# Altium schematic sheet Power-2.SchDoc: =ProjectTitle (part 2 of 2)
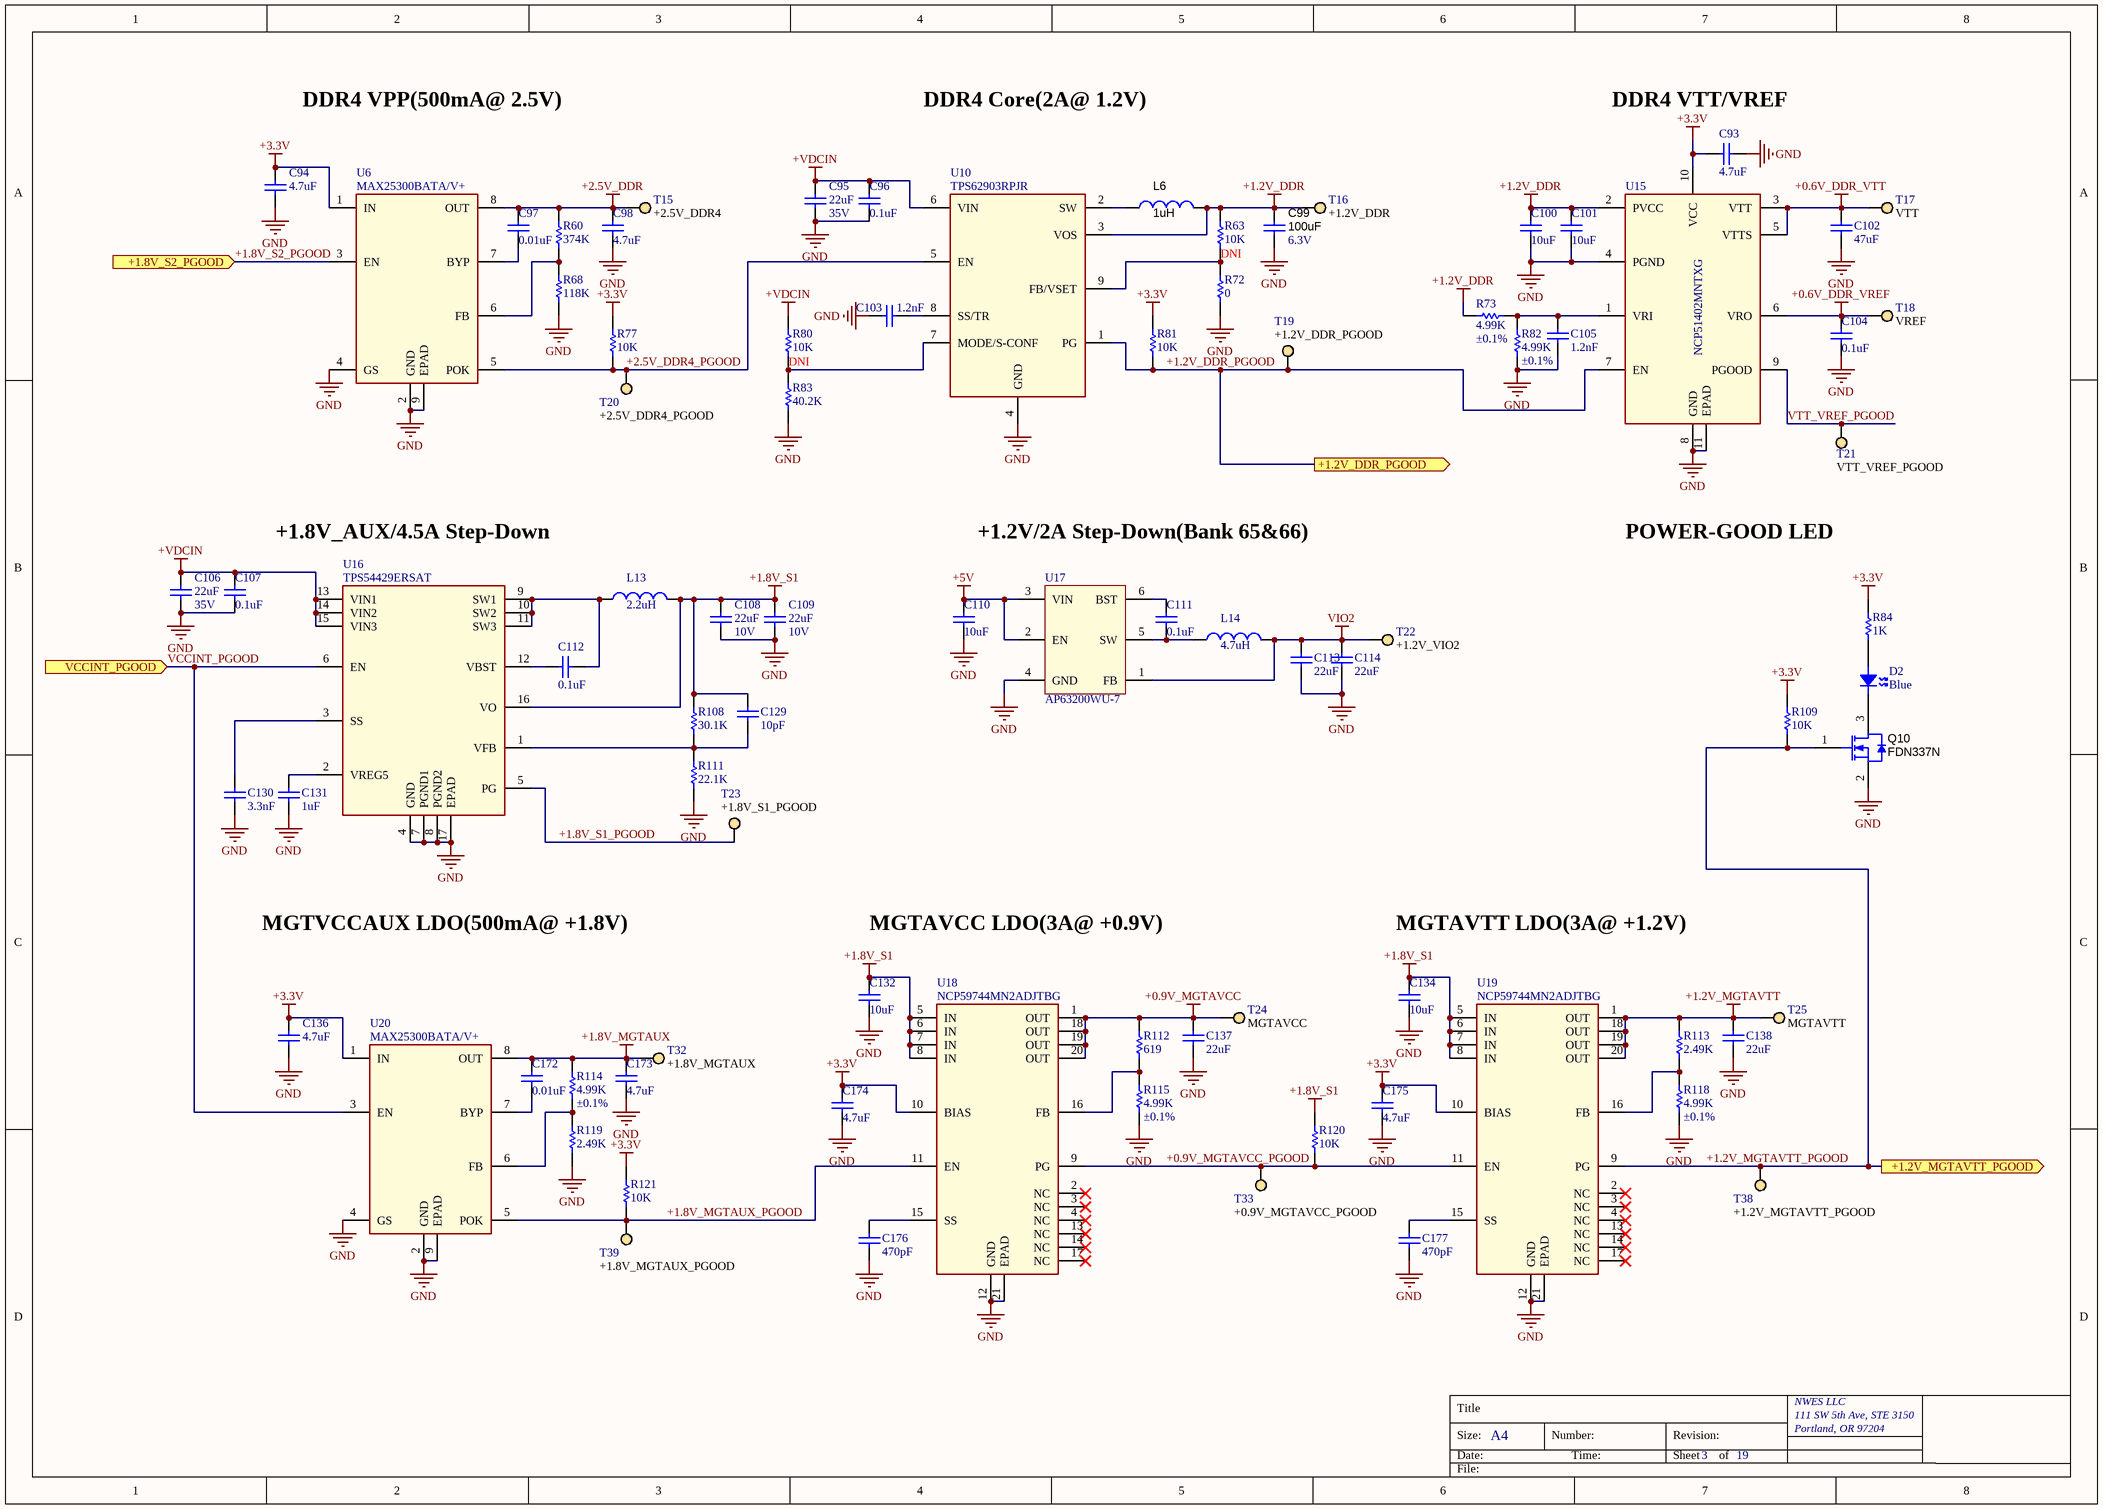
[diagram p1: Power-2.SchDoc]

## Library data of the parts
C93 C94 C98 C136 C173-C175 = CAP CER 4.7UF 10V X5R 0402: Manufacturer Part Number: C1005X5R1A475M050BC; Manufacturer: TDK Corporation; Package: 0402; Supplier Part Number 1: 445-8023-1-ND; Value: 4.7uF; Supplier 1: Digi-Key
C95 C106 = CAP CER 22UF 35V X5R 1206: C Series 1206 22 uF 35 V ±20 % Tolerance X5R SMT Multilayer Ceramic Capacitor; Manufacturer: TDK; Manufacturer Part Number: C3216X5R1V226M160AC; Tolerance: 20%; Supplier 1: Digi-Key; RoHS: Yes; Category: Ceramic Capacitors; Stock 1: 1100049; Pricing 1: 1=0.95000, 10=0.72200, 50=0.60000, 100=0.51660, 500=0.39996, 1000=0.34441 (USD); Mount: Surface Mount; Case/Package: 1206; Case Code (Metric): 3216; Case Code (Imperial): 1206; Weight: 0.000571oz; Dielectric Material: Ceramic; Min Operating Temperature: -55°C; Max Operating Temperature: 85°C; Capacitance: 22uF; Packaging: Tape and Reel; Termination: SMD/SMT; Series: C; Package Quantity: 2000; Voltage Rating (DC): 35V; Dielectric: X5R; Resistor Type: Ceramic; Voltage: 35V; Construction: Flat; Length: 3.2mm; Width: 0.063inch; Height: 1.6mm; Depth: 1.6mm; Thickness: 1.6mm; Radiation Hardening: No; Lead Free: Lead Free; RoHS Compliant: Yes; ComponentLink1URL: https://datasheet.ciiva.com/24216/c3216x5r1v226m160ac-265035-24216573.pdf?src-supplier=Mouser; ComponentLink1Description: https://datasheet.ciiva.com/24216/c3216x5r1v226m160ac-265035-24216573.pdf?src-supplier=Mouser; ComponentLink2URL: https://datasheet.ciiva.com/23803/1796654-23803046.pdf?src-supplier=Newark; ComponentLink2Description: https://datasheet.ciiva.com/23803/1796654-23803046.pdf?src-supplier=Newark; ComponentLink3URL: https://datasheet.ciiva.com/22725/1913358-22725591.pdf?src-supplier=Element14; ComponentLink3Description: https://datasheet.ciiva.com/22725/1913358-22725591.pdf?src-supplier=Element14; ComponentLink4URL: https://datasheet.ciiva.com/22725/1913358-22725592.pdf?src-supplier=Element14; ComponentLink4Description: https://datasheet.ciiva.com/22725/1913358-22725592.pdf?src-supplier=Element14; ComponentLink5URL: https://datasheet.ciiva.com/6259/tdkmlcccaprange-6259231.pdf?src-supplier=Digi-Key; ComponentLink5Description: https://datasheet.ciiva.com/6259/tdkmlcccaprange-6259231.pdf?src-supplier=Digi-Key; Supplier Part Number 1: 445-8045-1-ND
C96 C104 C107 C111 C112 = CAP CER 0.1UF 25V X5R 0402: Manufacturer Part Number: CL05A104KA5NNNC; Manufacturer: Samsung Electro-Mechanics; Supplier Part Number 1: 1276-1043-1-ND; Package: 0402; Height: 0.55mm; Supplier 1: Digi-Key; value: 0.1uF
C97 C172 = CAP CER 0.01uF 50V X7R 0402: CAP CER 10000PF 50V X7R 0402; Manufacturer Part Number: GCM155R71H103KA55D; Manufacturer: Murata Electronics; Supplier Part Number 1: 490-4762-1-ND; Package: 0402; Height: 0.55mm; Supplier 1: Digi-Key; value: 0.01uF
C99 = CAP CER 100UF 6.3V X5R 1206: 1206 100 uF 6.3 V ±20% Tolerance X5R SMT Multilayer Ceramic Capacitor; Manufacturer: Murata; Manufacturer Part Number: GRM31CR60J107ME39L; Supplier 1: Mouser; RoHS: Yes; Category: Ceramic Capacitors; Stock 1: 589630; Pricing 1: 1=1.08000, 10=0.79300, 50=0.79300, 100=0.54400, 1000=0.53900, 10000=0.44000 (USD); Mount: Surface Mount; Case/Package: 1206; Case Code (Metric): 3216; Case Code (Imperial): 1206; Min Operating Temperature: -55°C; Max Operating Temperature: 85°C; Packaging: Cut Tape; Voltage Rating: 6.3V; Dielectric: X5R; Tolerance: 20%; Capacitance: 100uF; Series: GRM; Length: 3.2mm; Width: 1.6mm; Thickness: 0.071inch; Reach SVHC Compliant: Yes; RoHS Compliant: Yes; ComponentLink1URL: https://datasheet.ciiva.com/142/grm31cr60j107me39-01-142571.pdf?src-supplier=Digi-Key; ComponentLink1Description: https://datasheet.ciiva.com/142/grm31cr60j107me39-01-142571.pdf?src-supplier=Digi-Key; ComponentLink2URL: https://datasheet.ciiva.com/142/grm31cr60j107me39-01-142572.pdf?src-supplier=Digi-Key; ComponentLink2Description: https://datasheet.ciiva.com/142/grm31cr60j107me39-01-142572.pdf?src-supplier=Digi-Key; ComponentLink3URL: https://datasheet.ciiva.com/3776/255grm31cr60j107me3923-3776999.pdf?src-supplier=Arrow+Electronics; ComponentLink3Description: https://datasheet.ciiva.com/3776/255grm31cr60j107me3923-3776999.pdf?src-supplier=Arrow+Electronics; ComponentLink4URL: https://datasheet.ciiva.com/11787/0900766b80ef921d-11787809.pdf?src-supplier=Rs; ComponentLink4Description: https://datasheet.ciiva.com/11787/0900766b80ef921d-11787809.pdf?src-supplier=Rs; ComponentLink5URL: https://datasheet.ciiva.com/29202/451152-da-01-de-vs-chip-kond-1206-100-0-uf-20pr-6-3v-x5r-29202463.pdf?src-supplier=Conrad; ComponentLink5Description: https://datasheet.ciiva.com/29202/451152-da-01-de-vs-chip-kond-1206-100-0-uf-20pr-6-3v-x5r-29202463.pdf?src-supplier=Conrad; Supplier Part Number 1: 81-GRM31CR60J107ME9L; Material: Ceramic; Weight: 0.001411oz; Package Quantity: 2000; Termination: Standard; Voltage: 6.3V; Height: 1.6mm; Depth: 1.6mm; Radiation Hardening: No; Lead Free: Lead Free; ComponentLink6URL: https://datasheet.ciiva.com/29199/454804-da-01-en-vs-kondensator-1206-29199543.pdf?src-supplier=Conrad; ComponentLink6Description: https://datasheet.ciiva.com/29199/454804-da-01-en-vs-kondensator-1206-29199543.pdf?src-supplier=Conrad; ComponentLink7URL: https://datasheet.ciiva.com/14116/grmseries-highdielectrictype-eng-14116431.pdf?src-supplier=Distrelec; ComponentLink7Description: https://datasheet.ciiva.com/14116/grmseries-highdielectrictype-eng-14116431.pdf?src-supplier=Distrelec; ComponentLink8URL: https://datasheet.ciiva.com/142/grm31cr60j107me39-01-142570.pdf?src-supplier=Digi-Key; ComponentLink8Description: https://datasheet.ciiva.com/142/grm31cr60j107me39-01-142570.pdf?src-supplier=Digi-Key; ComponentLink9URL: https://datasheet.ciiva.com/5416/product-5416441.pdf?src-supplier=Mouser; ComponentLink9Description: https://datasheet.ciiva.com/5416/product-5416441.pdf?src-supplier=Mouser; ComponentLink10URL: https://datasheet.ciiva.com/16461/product-16461259.pdf?src-supplier=Future+Electronics; ComponentLink10Description: https://datasheet.ciiva.com/16461/product-16461259.pdf?src-supplier=Future+Electronics
C100 C101 C110 C132 C134 = CAP CER 10UF 10V X5R 0402: Manufacturer Part Number: CL05A106MP8NUB8; Manufacturer: Samsung Electro-Mechanics; Part #: E-CAP-042; Supplier Part Number 1: 1276-6830-2-ND; Package: 0402; value: 10uF; Supplier 1: Digi-Key; Height: 0.9mm; ComponentLink1Description: New link; ComponentLink1URL: *
C102 = CAP CER 47UF 6.3V X5R 0805: Manufacturer: Samsung; Manufacturer Part Number: CL21A476MQYNNNE; Tolerance: 20%; Supplier 1: Digi-Key; RoHS: Yes; Category: Ceramic Capacitors; Stock 1: 1673694; Pricing 1: 1=0.29000, 10=0.20200, 50=0.13440, 100=0.11420, 500=0.08064, 1000=0.07057 (USD); Mount: Surface Mount; Case/Package: 0805; Case Code (Metric): 2012; Case Code (Imperial): 0805; Contact Plating: Tin; Min Operating Temperature: -55°C; Max Operating Temperature: 85°C; Capacitance: 47uF; Package Quantity: 1; Packaging: Tape and Reel; Dielectric: X5R; Series: CL; Construction: Flat; Length: 2mm; Width: 0.049inch; Height: 1.25mm; Thickness: 0.057inch; Depth: 1.25mm; Radiation Hardening: No; RoHS Compliant: Yes; ComponentLink1URL: https://datasheet.ciiva.com/25791/cl21a476mqynnne-25791153.pdf?src-supplier=Digi-Key; ComponentLink1Description: https://datasheet.ciiva.com/25791/cl21a476mqynnne-25791153.pdf?src-supplier=Digi-Key; ComponentLink2URL: https://datasheet.ciiva.com/26838/getdatasheetpartid-359050-26838632.pdf?src-supplier=Verical; ComponentLink2Description: https://datasheet.ciiva.com/26838/getdatasheetpartid-359050-26838632.pdf?src-supplier=Verical; Supplier Part Number 1: 1276-1852-1-ND; Voltage Rating: 6.3V
C103 C105 = CAP CER 1200PF 50V X7R 0402: 0402 1.2 nF 50 V ±10% Tolerance X7R SMT Multilayer Ceramic Capacitor; Manufacturer: Murata; Manufacturer Part Number: GRM155R71H122KA01D; Voltage Rating: 50V; Supplier 1: Digi-Key; RoHS: Yes; Category: Ceramic Capacitors; Stock 1: 373559; Pricing 1: 1=0.10000, 10=0.02800, 50=0.01520, 100=0.01240, 500=0.00886, 1000=0.00696, 2500=0.00632, 5000=0.00582 (USD); Mount: Surface Mount; Case/Package: 0402; Case Code (Metric): 1005; Case Code (Imperial): 0402; Material: Ceramic; Min Operating Temperature: -55°C; Max Operating Temperature: 125°C; Capacitance: 1.2nF; Tolerance: 10%; Dielectric: X7R; Packaging: Tape and Reel; Package Quantity: 1; Voltage Rating (DC): 50V; Termination: SMD/SMT; Voltage: 50V; Series: GRM; Construction: Flat; Length: 1mm; Width: 0.5mm; Height: 0.5mm; Thickness: 0.022inch; Depth: 0.5mm; Radiation Hardening: No; Lead Free: Lead Free; RoHS Compliant: Yes; ComponentLink1URL: https://datasheet.ciiva.com/18184/getdatasheetpartid-220777-18184722.pdf?src-supplier=Verical; ComponentLink1Description: https://datasheet.ciiva.com/18184/getdatasheetpartid-220777-18184722.pdf?src-supplier=Verical; ComponentLink2URL: https://datasheet.ciiva.com/161/partnumbering-e-01-161460.pdf?src-supplier=Digi-Key; ComponentLink2Description: https://datasheet.ciiva.com/161/partnumbering-e-01-161460.pdf?src-supplier=Digi-Key; ComponentLink3URL: https://datasheet.ciiva.com/161/partnumbering-e-01-161459.pdf?src-supplier=Digi-Key; ComponentLink3Description: https://datasheet.ciiva.com/161/partnumbering-e-01-161459.pdf?src-supplier=Digi-Key; ComponentLink4URL: https://datasheet.ciiva.com/161/partnumbering-e-01-161461.pdf?src-supplier=Digi-Key; ComponentLink4Description: https://datasheet.ciiva.com/161/partnumbering-e-01-161461.pdf?src-supplier=Digi-Key; ComponentLink5URL: https://datasheet.ciiva.com/2989/product-2989402.pdf?src-supplier=Avnet; ComponentLink5Description: https://datasheet.ciiva.com/2989/product-2989402.pdf?src-supplier=Avnet; Supplier Part Number 1: 490-1304-1-ND
C108 C109 = CAP CER 22UF 10V X5R 0603: Multilayer Ceramic Capacitor, 22 uF, 10 V, ± 20%, X5R, 0603 [1608 Metric]; Manufacturer: TDK; Manufacturer Part Number: C1608X5R1A226M080AC; Supplier 1: Digi-Key; RoHS: Yes; Category: Ceramic Capacitors; Stock 1: 4100481; Pricing 1: 1=0.45000, 10=0.31300, 50=0.21920, 100=0.18790, 500=0.14090, 1000=0.11898 (USD); Mount: Surface Mount; Case/Package: 0603; Case Code (Metric): 1608; Case Code (Imperial): 0603; Dielectric Material: Ceramic; Weight: 7.1E-05oz; Min Operating Temperature: -55°C; Max Operating Temperature: 85°C; Tolerance: 20%; Capacitance: 22uF; Packaging: Tape and Reel; Voltage Rating (DC): 10V; Termination: SMD/SMT; Series: C; Package Quantity: 4000; Dielectric: X5R; Resistor Type: Ceramic; Length: 1.6mm; Width: 0.8mm; Height: 0.8mm; Thickness: 0.035inch; Depth: 0.8mm; Reach SVHC Compliant: Yes; Lead Free: Lead Free; RoHS Compliant: Yes; ComponentLink1URL: https://datasheet.ciiva.com/6274/tdkmlcccaprange-6274860.pdf?src-supplier=Digi-Key; ComponentLink1Description: https://datasheet.ciiva.com/6274/tdkmlcccaprange-6274860.pdf?src-supplier=Digi-Key; ComponentLink2URL: https://datasheet.ciiva.com/6274/tdkmlcccaprange-6274859.pdf?src-supplier=Digi-Key; ComponentLink2Description: https://datasheet.ciiva.com/6274/tdkmlcccaprange-6274859.pdf?src-supplier=Digi-Key; ComponentLink3URL: https://datasheet.ciiva.com/6274/tdkmlcccaprange-6274861.pdf?src-supplier=Digi-Key; ComponentLink3Description: https://datasheet.ciiva.com/6274/tdkmlcccaprange-6274861.pdf?src-supplier=Digi-Key; ComponentLink4URL: https://datasheet.ciiva.com/24216/mlcc-commercial-general-en-24216575.pdf?src-supplier=Mouser; ComponentLink4Description: https://datasheet.ciiva.com/24216/mlcc-commercial-general-en-24216575.pdf?src-supplier=Mouser; Supplier Part Number 1: 445-9077-1-ND
C113 C114 C137 C138 = CAP CER 22UF 10V X5R 0603: Multilayer Ceramic Capacitor, 22 uF, 10 V, ± 20%, X5R, 0603 [1608 Metric]; Manufacturer: TDK; Manufacturer Part Number: C1608X5R1A226M080AC; Voltage Rating: 10V; Supplier 1: Digi-Key; RoHS: Yes; Category: Ceramic Capacitors; Stock 1: 4100481; Pricing 1: 1=0.45000, 10=0.31300, 50=0.21920, 100=0.18790, 500=0.14090, 1000=0.11898 (USD); Mount: Surface Mount; Case/Package: 0603; Case Code (Metric): 1608; Case Code (Imperial): 0603; Dielectric Material: Ceramic; Weight: 7.1E-05oz; Min Operating Temperature: -55°C; Max Operating Temperature: 85°C; Tolerance: 20%; Capacitance: 22uF; Packaging: Tape and Reel; Voltage Rating (DC): 10V; Termination: SMD/SMT; Series: C; Package Quantity: 4000; Dielectric: X5R; Resistor Type: Ceramic; Length: 1.6mm; Width: 0.8mm; Height: 0.8mm; Thickness: 0.035inch; Depth: 0.8mm; Reach SVHC Compliant: Yes; Lead Free: Lead Free; RoHS Compliant: Yes; ComponentLink1URL: https://datasheet.ciiva.com/6274/tdkmlcccaprange-6274860.pdf?src-supplier=Digi-Key; ComponentLink1Description: https://datasheet.ciiva.com/6274/tdkmlcccaprange-6274860.pdf?src-supplier=Digi-Key; ComponentLink2URL: https://datasheet.ciiva.com/6274/tdkmlcccaprange-6274859.pdf?src-supplier=Digi-Key; ComponentLink2Description: https://datasheet.ciiva.com/6274/tdkmlcccaprange-6274859.pdf?src-supplier=Digi-Key; ComponentLink3URL: https://datasheet.ciiva.com/6274/tdkmlcccaprange-6274861.pdf?src-supplier=Digi-Key; ComponentLink3Description: https://datasheet.ciiva.com/6274/tdkmlcccaprange-6274861.pdf?src-supplier=Digi-Key; ComponentLink4URL: https://datasheet.ciiva.com/24216/mlcc-commercial-general-en-24216575.pdf?src-supplier=Mouser; ComponentLink4Description: https://datasheet.ciiva.com/24216/mlcc-commercial-general-en-24216575.pdf?src-supplier=Mouser; Supplier Part Number 1: 445-9077-1-ND
C129 = CAP CER 10PF 50V C0G/NP0 0402: 0402 10 pF 50 V ±5% Tolerance C0G SMT Multilayer Ceramic Capacitor; Manufacturer: Murata; Manufacturer Part Number: GRM1555C1H100JA01D; Voltage Rating: 50V; Temperature Coefficient: 30ppm/°C; Supplier 1: Digi-Key; RoHS: Yes; Category: Ceramic Capacitors; Stock 1: 7638732; Pricing 1: 1=0.10000, 10=0.02200, 50=0.01220, 100=0.00990, 500=0.00708, 1000=0.00556, 2500=0.00505, 5000=0.00465 (USD); Mount: Surface Mount; Case/Package: 0402; Number of Pins: 2; Case Code (Metric): 1005; Case Code (Imperial): 0402; Material: Ceramic; Min Operating Temperature: -55°C; Max Operating Temperature: 125°C; Capacitance: 10pF; Dielectric: C0G; Packaging: Tape and Reel; Package Quantity: 1; Voltage Rating (DC): 50V; Termination: SMD/SMT; Series: GRM; Tolerance: 5%; Voltage: 50V; Construction: Flat; Length: 1mm; Width: 0.02inch; Height: 0.5mm; Thickness: 0.022inch; Depth: 0.5mm; Radiation Hardening: No; RoHS Compliant: Yes; Lead Free: Lead Free; Reach SVHC Compliant: Yes; ComponentLink1URL: https://datasheet.ciiva.com/2989/product-2989280.pdf?src-supplier=Avnet; ComponentLink1Description: https://datasheet.ciiva.com/2989/product-2989280.pdf?src-supplier=Avnet; ComponentLink2URL: https://datasheet.ciiva.com/18184/getdatasheetpartid-307234-18184164.pdf?src-supplier=Verical; ComponentLink2Description: https://datasheet.ciiva.com/18184/getdatasheetpartid-307234-18184164.pdf?src-supplier=Verical; ComponentLink3URL: https://datasheet.ciiva.com/29200/453545-da-01-en-vs-kondensator-0402-29200107.pdf?src-supplier=Conrad; ComponentLink3Description: https://datasheet.ciiva.com/29200/453545-da-01-en-vs-kondensator-0402-29200107.pdf?src-supplier=Conrad; ComponentLink4URL: https://datasheet.ciiva.com/7828/1666664-7828812.pdf?src-supplier=Element14; ComponentLink4Description: https://datasheet.ciiva.com/7828/1666664-7828812.pdf?src-supplier=Element14; ComponentLink5URL: https://datasheet.ciiva.com/6271/partnumbering-e-01-6271159.pdf?src-supplier=Digi-Key; ComponentLink5Description: https://datasheet.ciiva.com/6271/partnumbering-e-01-6271159.pdf?src-supplier=Digi-Key; ComponentLink6URL: https://datasheet.ciiva.com/6271/partnumbering-e-01-6271158.pdf?src-supplier=Digi-Key; ComponentLink6Description: https://datasheet.ciiva.com/6271/partnumbering-e-01-6271158.pdf?src-supplier=Digi-Key; ComponentLink7URL: https://datasheet.ciiva.com/6271/partnumbering-e-01-6271068.pdf?src-supplier=Digi-Key; ComponentLink7Description: https://datasheet.ciiva.com/6271/partnumbering-e-01-6271068.pdf?src-supplier=Digi-Key; ComponentLink8URL: https://datasheet.ciiva.com/48671/product-48671350.pdf?src-supplier=Avnet; ComponentLink8Description: https://datasheet.ciiva.com/48671/product-48671350.pdf?src-supplier=Avnet; Supplier Part Number 1: 490-5921-1-ND
C130 = CAP CER 3300PF 50V X7R 0402: 0402 3.3 nF 50 V ±10% Tolerance X7R SMT Multilayer Ceramic Capacitor; Manufacturer: Murata; Manufacturer Part Number: GRM155R71H332KA01D; Voltage Rating (DC): 50V; Dissipation Factor: 0.025%; Insulation Resistance: 10GR; Supplier 1: Digi-Key; RoHS: Yes; Category: Ceramic Capacitors; Stock 1: 1429301; Pricing 1: 1=0.10000, 10=0.02800, 50=0.01520, 100=0.01240, 500=0.00886, 1000=0.00696, 2500=0.00632, 5000=0.00582 (USD); Mount: Surface Mount; Case/Package: 0402; Case Code (Metric): 1005; Case Code (Imperial): 0402; Material: Ceramic; Min Operating Temperature: -55°C; Max Operating Temperature: 125°C; Capacitance: 3.3nF; Tolerance: 10%; Package Quantity: 1; Packaging: Tape and Reel; Voltage Rating: 50V; Dielectric: X7R; Termination: SMD/SMT; Voltage: 50V; Series: GRM; Construction: Flat; Length: 1mm; Width: 0.02inch; Height: 0.5mm; Thickness: 0.022inch; Depth: 0.5mm; Radiation Hardening: No; Reach SVHC Compliant: Yes; Lead Free: Lead Free; RoHS Compliant: Yes; ComponentLink1URL: https://datasheet.ciiva.com/129/grm155r71h332ka01-01-129766.pdf?src-supplier=Digi-Key; ComponentLink1Description: https://datasheet.ciiva.com/129/grm155r71h332ka01-01-129766.pdf?src-supplier=Digi-Key; ComponentLink2URL: https://datasheet.ciiva.com/129/grm155r71h332ka01-01-129767.pdf?src-supplier=Digi-Key; ComponentLink2Description: https://datasheet.ciiva.com/129/grm155r71h332ka01-01-129767.pdf?src-supplier=Digi-Key; ComponentLink3URL: https://datasheet.ciiva.com/11789/0900766b80ef921d-11789161.pdf?src-supplier=RSComponents; ComponentLink3Description: https://datasheet.ciiva.com/11789/0900766b80ef921d-11789161.pdf?src-supplier=RSComponents; ComponentLink4URL: https://datasheet.ciiva.com/5422/product-5422403.pdf?src-supplier=Mouser; ComponentLink4Description: https://datasheet.ciiva.com/5422/product-5422403.pdf?src-supplier=Mouser; ComponentLink5URL: https://datasheet.ciiva.com/18184/getdatasheetpartid-149678-18184747.pdf?src-supplier=Verical; ComponentLink5Description: https://datasheet.ciiva.com/18184/getdatasheetpartid-149678-18184747.pdf?src-supplier=Verical; ComponentLink6URL: https://datasheet.ciiva.com/29199/454326-da-01-en-vs-kondensator-0402-29199651.pdf?src-supplier=Conrad; ComponentLink6Description: https://datasheet.ciiva.com/29199/454326-da-01-en-vs-kondensator-0402-29199651.pdf?src-supplier=Conrad; ComponentLink7URL: https://datasheet.ciiva.com/14116/grmseries-highdielectrictype-eng-14116909.pdf?src-supplier=Distrelec; ComponentLink7Description: https://datasheet.ciiva.com/14116/grmseries-highdielectrictype-eng-14116909.pdf?src-supplier=Distrelec; ComponentLink8URL: https://datasheet.ciiva.com/2989/product-2989413.pdf?src-supplier=Avnet; ComponentLink8Description: https://datasheet.ciiva.com/2989/product-2989413.pdf?src-supplier=Avnet; ComponentLink9URL: https://datasheet.ciiva.com/16199/product-16199259.pdf?src-supplier=Future+Electronics; ComponentLink9Description: https://datasheet.ciiva.com/16199/product-16199259.pdf?src-supplier=Future+Electronics; ComponentLink10URL: https://datasheet.ciiva.com/48671/product-48671326.pdf?src-supplier=Avnet; ComponentLink10Description: https://datasheet.ciiva.com/48671/product-48671326.pdf?src-supplier=Avnet; Supplier Part Number 1: 490-3248-1-ND
C131 = CAP CER 1UF 25V X5R 0402: Manufacturer Part Number: GRM155R61E105MA12D; Manufacturer: Murata Electronics; Part #: E-CAP-042; Supplier Part Number 1: 490-10018-1-ND; Package: 0402; value: 1uF; Supplier 1: Digi-Key; Height: 0.55mm; ComponentLink1Description: New link; ComponentLink1URL: *
C176 C177 = CAP CER 470PF 50V X7R 0402: Multilayer Ceramic Capacitor, Grm Series, 470 Pf, - 10%, X7R, 50 V, 0402 [1005 Metric] Rohs Compliant: Yes; Manufacturer: Murata; Manufacturer Part Number: GRM155R71H471KA01D; Voltage Rating: 50V; Supplier 1: Digi-Key; RoHS: Yes; Category: Ceramic Capacitors; Stock 1: 2912841; Pricing 1: 1=0.10000, 10=0.04700, 50=0.02580, 100=0.02100, 500=0.01502, 1000=0.01180, 2500=0.01072, 5000=0.00987 (USD); Mount: Surface Mount; Case/Package: 0402; Number of Pins: 2; Case Code (Metric): 1005; Case Code (Imperial): 0402; Material: Ceramic; Min Operating Temperature: -55°C; Max Operating Temperature: 125°C; Capacitance: 470pF; Tolerance: 10%; Dielectric: X7R; Package Quantity: 1; Packaging: Tape and Reel; Voltage Rating (DC): 50V; Termination: SMD/SMT; Voltage: 50V; Series: GRM; Construction: Flat; Length: 1mm; Width: 0.02inch; Height: 0.5mm; Thickness: 0.022inch; Depth: 0.5mm; Size: 0.5mm; Radiation Hardening: No; Reach SVHC Compliant: Yes; Lead Free: Lead Free; RoHS Compliant: Yes; ComponentLink1URL: https://datasheet.ciiva.com/19476/1856505-19476137.pdf?src-supplier=Jameco; ComponentLink1Description: https://datasheet.ciiva.com/19476/1856505-19476137.pdf?src-supplier=Jameco; ComponentLink2URL: https://datasheet.ciiva.com/11786/0900766b80ef921d-11786912.pdf?src-supplier=RSComponents; ComponentLink2Description: https://datasheet.ciiva.com/11786/0900766b80ef921d-11786912.pdf?src-supplier=RSComponents; ComponentLink3URL: https://datasheet.ciiva.com/18101/getdatasheetpartid-37722-18101030.pdf?src-supplier=Verical; ComponentLink3Description: https://datasheet.ciiva.com/18101/getdatasheetpartid-37722-18101030.pdf?src-supplier=Verical; ComponentLink4URL: https://datasheet.ciiva.com/29199/454340-da-01-en-vs-kondensator-0402-29199656.pdf?src-supplier=Conrad; ComponentLink4Description: https://datasheet.ciiva.com/29199/454340-da-01-en-vs-kondensator-0402-29199656.pdf?src-supplier=Conrad; ComponentLink5URL: https://datasheet.ciiva.com/14116/grmseries-highdielectrictype-eng-14116837.pdf?src-supplier=Distrelec; ComponentLink5Description: https://datasheet.ciiva.com/14116/grmseries-highdielectrictype-eng-14116837.pdf?src-supplier=Distrelec; ComponentLink6URL: https://datasheet.ciiva.com/7937/608985-7937630.pdf?src-supplier=Element14; ComponentLink6Description: https://datasheet.ciiva.com/7937/608985-7937630.pdf?src-supplier=Element14; ComponentLink7URL: https://datasheet.ciiva.com/22698/608985-22698425.pdf?src-supplier=Element14; ComponentLink7Description: https://datasheet.ciiva.com/22698/608985-22698425.pdf?src-supplier=Element14; ComponentLink8URL: https://datasheet.ciiva.com/129/partnumbering-e-01-129844.pdf?src-supplier=Digi-Key; ComponentLink8Description: https://datasheet.ciiva.com/129/partnumbering-e-01-129844.pdf?src-supplier=Digi-Key; ComponentLink9URL: https://datasheet.ciiva.com/129/partnumbering-e-01-129843.pdf?src-supplier=Digi-Key; ComponentLink9Description: https://datasheet.ciiva.com/129/partnumbering-e-01-129843.pdf?src-supplier=Digi-Key; ComponentLink10URL: https://datasheet.ciiva.com/129/partnumbering-e-01-129845.pdf?src-supplier=Digi-Key; ComponentLink10Description: https://datasheet.ciiva.com/129/partnumbering-e-01-129845.pdf?src-supplier=Digi-Key; ComponentLink11URL: https://datasheet.ciiva.com/16199/product-16199180.pdf?src-supplier=Future+Electronics; ComponentLink11Description: https://datasheet.ciiva.com/16199/product-16199180.pdf?src-supplier=Future+Electronics; Supplier Part Number 1: 490-1300-1-ND
D2 = LED BLUE CLEAR CHIP SMD 0603: LED BLUE CLEAR 0603 SMD; Manufacturer: Vishay Lite-On; Manufacturer Part Number: LTST-C191TBKT; Lens Color: Colorless; Viewing Angle: 130°; Lens Style: Diffused,Colorless,Clear,Rectangular; Forward Voltage: 3.8V; Luminous Intensity: 180mcd; Dominant Wavelength: 475nm; Test Current: 20mA; Number of LEDs: 1; Wavelength: 468nm; Reverse Voltage: 5V; Max Power Dissipation: 75mW; Power Dissipation: 76mW; Supplier 1: Digi-Key; RoHS: Yes; Category: LEDs; Stock 1: 577602; Pricing 1: 1=0.33000, 10=0.26200, 100=0.11780, 500=0.10640, 1000=0.08740, 2000=0.07600 (USD); Mount: Surface Mount; Case/Package: 0603; Number of Pins: 2; Color: Blue; Case Code (Metric): 1608; Case Code (Imperial): 0603; Min Operating Temperature: -20°C; Max Operating Temperature: 80°C; Packaging: Tape and Reel; Package Quantity: 1; Lens Transparency: Clear; Forward Current: 20mA; Illumination Color: Blue; Number of Elements: 1; Length: 0.8mm; Width: 0.8mm; Height: 0.55mm; Depth: 1.6mm; Radiation Hardening: No; RoHS Compliant: Yes; Lead Free: Lead Free; ComponentLink1URL: https://datasheet.ciiva.com/2110/ltst-c191tbkt-2110256.pdf?src-supplier=Digi-Key; ComponentLink1Description: https://datasheet.ciiva.com/2110/ltst-c191tbkt-2110256.pdf?src-supplier=Digi-Key; ComponentLink2URL: https://datasheet.ciiva.com/19465/2047945-19465673.pdf?src-supplier=Jameco; ComponentLink2Description: https://datasheet.ciiva.com/19465/2047945-19465673.pdf?src-supplier=Jameco; ComponentLink3URL: https://datasheet.ciiva.com/11774/0900766b80dc02b4-11774413.pdf?src-supplier=RSComponents; ComponentLink3Description: https://datasheet.ciiva.com/11774/0900766b80dc02b4-11774413.pdf?src-supplier=RSComponents; ComponentLink4URL: https://datasheet.ciiva.com/12400/lite-on-ltst-c191tbkt-187207-12400737.pdf?src-supplier=Mouser; ComponentLink4Description: https://datasheet.ciiva.com/12400/lite-on-ltst-c191tbkt-187207-12400737.pdf?src-supplier=Mouser; ComponentLink5URL: https://datasheet.ciiva.com/16444/ltst-c191tbkt-16444756.pdf?src-supplier=Future+Electronics; ComponentLink5Description: https://datasheet.ciiva.com/16444/ltst-c191tbkt-16444756.pdf?src-supplier=Future+Electronics; ComponentLink6URL: https://datasheet.ciiva.com/15117/getdatasheetpartid-133342-15117680.pdf?src-supplier=Verical; ComponentLink6Description: https://datasheet.ciiva.com/15117/getdatasheetpartid-133342-15117680.pdf?src-supplier=Verical; ComponentLink7URL: https://datasheet.ciiva.com/2110/s-110-ltst-c191tbkt-2110257.pdf?src-supplier=Digi-Key; ComponentLink7Description: https://datasheet.ciiva.com/2110/s-110-ltst-c191tbkt-2110257.pdf?src-supplier=Digi-Key; Supplier Part Number 1: 160-1647-1-ND
L6 = FIXED IND 1UH 3.3A 40 MOHM SMD: Inductor Power Chip Shielded Wirewound 1uH 20% 1MHz Metal 3.3A 0.04Ohm DCR 1008 T/R; Manufacturer: Murata; Manufacturer Part Number: DFE252012F-1R0M=P2; Core Material: Ferrite; Saturation Current: 5.3A; DC Resistance (DCR): 40mR; Supplier 1: Digi-Key; RoHS: Yes; Category: Fixed Inductors; Stock 1: 280963; Pricing 1: 1=0.35000, 10=0.31500, 25=0.27560, 50=0.23640, 100=0.21660, 250=0.19696, 500=0.18514, 1000=0.14180 (USD); Mount: Surface Mount; Case/Package: 1008; Case Code (Metric): 2520; Case Code (Imperial): 1008; Min Operating Temperature: -40°C; Max Operating Temperature: 125°C; Packaging: Tape and Reel; Inductance: 1uH; Current Rating: 3.3A; Shielding: Shielded; Test Frequency: 1MHz; Tolerance: 20%; Length: 0.098inch; Width: 0.079inch; Height - Seated (Max): 0.047inch; RoHS Compliant: Yes; ComponentLink1URL: http://www.farnell.com/datasheets/2616788.pdf?src-supplier=Farnell; ComponentLink1Description: http://www.farnell.com/datasheets/2616788.pdf?src-supplier=Farnell; ComponentLink2URL: https://www.murata.com/~/media/webrenewal/products/inductor/chip/tokoproducts/wirewoundmetalalloychiptype/m_dfe252012f.ashx?src-supplier=Digi-Key; ComponentLink2Description: https://www.murata.com/~/media/webrenewal/products/inductor/chip/tokoproducts/wirewoundmetalalloychiptype/m_dfe252012f.ashx?src-supplier=Digi-Key; Supplier Part Number 1: 490-13053-1-ND
L13 = FIXED IND 2.2UH 8.2A 19 MOHM SMD: Inductor Power Shielded Wirewound 2.2uH 20% 100KHz Metal 8.2A 19mOhm DCR Blister T/R; Manufacturer: TDK; Manufacturer Part Number: SPM6530T-2R2M; Saturation Current: 8.4A; DC Resistance (DCR): 19mR; Supplier 1: Digi-Key; RoHS: Yes; Category: Fixed Inductors; Stock 1: 31562; Pricing 1: 1=1.29000, 10=1.19400, 25=1.10240, 50=0.91880, 100=0.86360, 250=0.77176, 500=0.66150 (USD); Mount: Surface Mount; Case/Package: Nonstandard; Number of Pins: 2; Core Material: Metal; Min Operating Temperature: -40°C; Max Operating Temperature: 125°C; Inductance Tolerance: 20%; Package Quantity: 1000; Packaging: Tape and Reel; Tolerance: 20%; Shielding: Shielded; Current Rating: 8.2A; Inductance: 2.2uH; Max DC Current: 8.2A; Termination: SMD/SMT; Test Frequency: 100kHz; Resistor Type: Wirewound; RMS Current (Irms): 8.2A; DC Current: 8.2A; Series: SPM; Length: 7.1mm; Width: 6.5mm; Height: 3mm; Height - Seated (Max): 0.118inch; Depth: 6.8mm; Radiation Hardening: No; RoHS Compliant: Yes; Reach SVHC Compliant: Yes; Military Standard: Not; Lead Free: Lead Free; ComponentLink1URL: https://datasheet.ciiva.com/14869/print-detail-pdf-phplangenpart-nospm6530t-2r2mnreimp-unit-xmhzimp-14869558.pdf?src-supplier=Arrow+Electronics; ComponentLink1Description: https://datasheet.ciiva.com/14869/print-detail-pdf-phplangenpart-nospm6530t-2r2mnreimp-unit-xmhzimp-14869558.pdf?src-supplier=Arrow+Electronics; ComponentLink2URL: https://datasheet.ciiva.com/22729/e531-spm-22729327.pdf?src-supplier=Element14; ComponentLink2Description: https://datasheet.ciiva.com/22729/e531-spm-22729327.pdf?src-supplier=Element14; ComponentLink3URL: https://datasheet.ciiva.com/8045/1649093-8045740.pdf?src-supplier=Element14; ComponentLink3Description: https://datasheet.ciiva.com/8045/1649093-8045740.pdf?src-supplier=Element14; ComponentLink4URL: https://datasheet.ciiva.com/1047/e531-spm-1047417.pdf?src-supplier=Digi-Key; ComponentLink4Description: https://datasheet.ciiva.com/1047/e531-spm-1047417.pdf?src-supplier=Digi-Key; ComponentLink5URL: https://datasheet.ciiva.com/1047/e531-spm-1047416.pdf?src-supplier=Digi-Key; ComponentLink5Description: https://datasheet.ciiva.com/1047/e531-spm-1047416.pdf?src-supplier=Digi-Key; ComponentLink6URL: https://datasheet.ciiva.com/1047/e531-spm-1047418.pdf?src-supplier=Digi-Key; ComponentLink6Description: https://datasheet.ciiva.com/1047/e531-spm-1047418.pdf?src-supplier=Digi-Key; ComponentLink7URL: https://datasheet.ciiva.com/8498/e531-spm-8498184.pdf?src-supplier=Avnet; ComponentLink7Description: https://datasheet.ciiva.com/8498/e531-spm-8498184.pdf?src-supplier=Avnet; ComponentLink8URL: https://datasheet.ciiva.com/15992/e531-spm6530-15992140.pdf?src-supplier=Onlinecomponents.com; ComponentLink8Description: https://datasheet.ciiva.com/15992/e531-spm6530-15992140.pdf?src-supplier=Onlinecomponents.com; Supplier Part Number 1: 445-4118-1-ND
L14 = FIXED IND 4.7UH 2A 200 MOHM SMD: Manufacturer: Murata; Manufacturer Part Number: DFE252012P-4R7M=P2; Core Material: Ferrite; Shielding: Shielded; DC Resistance (DCR): 200mR; Test Frequency: 1MHz; Max DC Current: 1.4A; Tolerance: 20%; Supplier 1: Digi-Key; RoHS: Yes; Category: Fixed Inductors; Stock 1: 151905; Pricing 1: 1=0.31000, 10=0.27500, 25=0.24040, 50=0.20600, 100=0.18890, 250=0.17168, 500=0.16140, 1000=0.12362 (USD); Mount: Surface Mount; Case/Package: 1008; Case Code (Metric): 2520; Case Code (Imperial): 1008; Min Operating Temperature: -40°C; Max Operating Temperature: 125°C; Inductance: 4.7uH; Packaging: Tape and Reel; Resistor Type: Wirewound,Metal Alloy; Current Rating: 2A; Length: 0.098inch; Width: 0.079inch; Height - Seated (Max): 0.047inch; Depth: 2mm; RoHS Compliant: Yes; ComponentLink1URL: http://www.farnell.com/datasheets/2550138.pdf?src-supplier=Farnell; ComponentLink1Description: http://www.farnell.com/datasheets/2550138.pdf?src-supplier=Farnell; ComponentLink2URL: http://www.toko.co.jp/products/pdf/inductors/dfe252012p.pdf?src-supplier=Avnet; ComponentLink2Description: http://www.toko.co.jp/products/pdf/inductors/dfe252012p.pdf?src-supplier=Avnet; ComponentLink3URL: http://www.farnell.com/datasheets/2550138.pdf?src-supplier=Newark; ComponentLink3Description: http://www.farnell.com/datasheets/2550138.pdf?src-supplier=Newark; ComponentLink4URL: http://www.murata.com/~/media/webrenewal/products/inductor/chip/tokoproducts/wirewoundmetalalloychiptype/m_dfe252012p.ashx?src-supplier=Digi-Key; ComponentLink4Description: http://www.murata.com/~/media/webrenewal/products/inductor/chip/tokoproducts/wirewoundmetalalloychiptype/m_dfe252012p.ashx?src-supplier=Digi-Key; ComponentLink5URL: https://www.murata.com/~/media/webrenewal/products/inductor/chip/tokoproducts/wirewoundmetalalloychiptype/m_dfe252012p.ashx?src-supplier=Digi-Key; ComponentLink5Description: https://www.murata.com/~/media/webrenewal/products/inductor/chip/tokoproducts/wirewoundmetalalloychiptype/m_dfe252012p.ashx?src-supplier=Digi-Key; Supplier Part Number 1: 490-10651-1-ND
Q10 = MOSFET N-CH 30V 2.2A SUPERSOT3: MOSFET N-CH 30V 2.2A SSOT3; Manufacturer: ON Semiconductor / Fairchild; Drain to Source Resistance: 65mR; Gate to Source Voltage (Vgs): 8V; Power Dissipation: 500mW; Turn-Off Delay Time: 17ns; Element Configuration: Single; Rise Time: 10ns; Turn-On Delay Time: 4ns; Input Capacitance: 300pF; Number of Elements: 1; Threshold Voltage: 700mV; Polarity: N-CHANNEL; Supplier 1: Digi-Key; Manufacturer Part Number: FDN337N; RoHS: Yes; Category: MOSFETs; Stock 1: 48367; Pricing 1: 1=0.49000, 10=0.42000, 100=0.31350, 500=0.24636, 1000=0.19037 (USD); Mount: Surface Mount; Case/Package: TO-236-3; Number of Pins: 3; Contact Plating: Tin,Matte; Weight: 0.03g; Min Operating Temperature: -55°C; Max Operating Temperature: 150°C; Continuous Drain Current (ID): 2.2A; Packaging: Tape and Reel; Drain to Source Breakdown Voltage: 30V; Max Power Dissipation: 500mW; Drain to Source Voltage (Vdss): 30V; Fall Time: 10ns; Package Quantity: 3000; Rds On Max: 65mR; Voltage Rating (DC): 30V; Current Rating: 2.2A; On-State Resistance: 65mR; Series: -; Drain-source On Resistance-Max: 65mR; Dual Supply Voltage: 30V; Termination: SMD/SMT; Nominal Vgs: 700mV; Length: 2.92mm; Width: 3.05mm; Height: 0.94mm; Lead Free: Lead Free; RoHS Compliant: Yes; Reach SVHC Compliant: Yes; ComponentLink1URL: https://datasheet.ciiva.com/14092/fdn337n-eng-datasheet-14092051.pdf?src-supplier=Distrelec; ComponentLink1Description: https://datasheet.ciiva.com/14092/fdn337n-eng-datasheet-14092051.pdf?src-supplier=Distrelec; ComponentLink2URL: https://datasheet.ciiva.com/4442/fdn337n-44286-4442315.pdf?src-supplier=Mouser; ComponentLink2Description: https://datasheet.ciiva.com/4442/fdn337n-44286-4442315.pdf?src-supplier=Mouser; ComponentLink3URL: https://datasheet.ciiva.com/19470/871017-19470804.pdf?src-supplier=Jameco; ComponentLink3Description: https://datasheet.ciiva.com/19470/871017-19470804.pdf?src-supplier=Jameco; ComponentLink4URL: https://datasheet.ciiva.com/6037/fdn337n-6037720.pdf?src-supplier=Farnell; ComponentLink4Description: https://datasheet.ciiva.com/6037/fdn337n-6037720.pdf?src-supplier=Farnell; ComponentLink5URL: https://datasheet.ciiva.com/22681/220571-22681884.pdf?src-supplier=Element14; ComponentLink5Description: https://datasheet.ciiva.com/22681/220571-22681884.pdf?src-supplier=Element14; ComponentLink6URL: https://datasheet.ciiva.com/22655/220571-22655333.pdf?src-supplier=Element14; ComponentLink6Description: https://datasheet.ciiva.com/22655/220571-22655333.pdf?src-supplier=Element14; ComponentLink7URL: https://datasheet.ciiva.com/7968/220571-7968126.pdf?src-supplier=Element14; ComponentLink7Description: https://datasheet.ciiva.com/7968/220571-7968126.pdf?src-supplier=Element14; ComponentLink8URL: https://datasheet.ciiva.com/8115/fdn337n-8115069.pdf?src-supplier=Avnet; ComponentLink8Description: https://datasheet.ciiva.com/8115/fdn337n-8115069.pdf?src-supplier=Avnet; ComponentLink9URL: https://datasheet.ciiva.com/16931/fdn337n-16931214.pdf?src-supplier=Future+Electronics; ComponentLink9Description: https://datasheet.ciiva.com/16931/fdn337n-16931214.pdf?src-supplier=Future+Electronics; ComponentLink10URL: https://datasheet.ciiva.com/8115/fdn337n-8115063.pdf?src-supplier=Avnet; ComponentLink10Description: https://datasheet.ciiva.com/8115/fdn337n-8115063.pdf?src-supplier=Avnet; ComponentLink11URL: https://datasheet.ciiva.com/931/fdn337n-931876.pdf?src-supplier=Digi-Key; ComponentLink11Description: https://datasheet.ciiva.com/931/fdn337n-931876.pdf?src-supplier=Digi-Key; ComponentLink12URL: https://datasheet.ciiva.com/931/fdn337n-931877.pdf?src-supplier=Digi-Key; ComponentLink12Description: https://datasheet.ciiva.com/931/fdn337n-931877.pdf?src-supplier=Digi-Key; ComponentLink13URL: https://datasheet.ciiva.com/931/fdn337n-931875.pdf?src-supplier=Digi-Key; ComponentLink13Description: https://datasheet.ciiva.com/931/fdn337n-931875.pdf?src-supplier=Digi-Key; Supplier Part Number 1: FDN337NCT-ND
R60 = RES 374K OHM 1% 1/16W 0402: Manufacturer: YAGEO; Manufacturer Part Number: RC0402FR-07374KL; Supplier Part Number 1: YAG3136CT-ND; Supplier 1: Digi-Key; Height: 0.4mm; Package: 0402; value: 374K
R63 R77 R80 R81 R109 R120 R121 = RES 10K OHM 1% 1/16W 0402: Manufacturer: YAGEO; Manufacturer Part Number: RC0402FR-0710KL; Supplier Part Number 1: 311-10.0KLRCT-ND; Package: 0402; Height: 0.4mm; Supplier 1: Digi-Key; value: 10K; Tolerance: ±1%
R68 = RES 118K OHM 1% 1/16W 0402: Manufacturer: YAGEO; Manufacturer Part Number: RC0402FR-07118KL; Supplier Part Number 1: YAG2369CT-ND; Supplier 1: Digi-Key; Height: 0.4mm; Package: 0402; value: 118K
R72 = RES 0 OHM JUMPER 1/16W 0402: Manufacturer: Yageo; Manufacturer Part Number: RC0402JR-070RL; Supplier Part Number 1: 311-0.0JRTR-ND; Package: 0402; Height: 0.4mm; Supplier 1: Digi-Key; value: 0
R73 R82 R114 R115 R118 = RES 4.99KOHM 0.1% 1/16W 0402: RES SMD 4.99KOHM 0.1% 1/16W 0402; Manufacturer: YAGEO; Manufacturer Part Number: RT0402BRD074K99L; Supplier Part Number 1: YAG1447CT-ND; Supplier 1: Digi-Key; Height: 0.4mm; Package: 0402; value: 4.99K
R83 = RES 40.2K OHM 1% 1/16W 0402: Manufacturer: YAGEO; Manufacturer Part Number: RC0402FR-0740K2L; Supplier Part Number 1: 311-40.2KLRCT-ND; Supplier 1: Digi-Key; Height: 0.4mm; Package: 0402; value: 40.2K
R84 = RES 1K OHM 1% 1/16W 0402: Manufacturer: YAGEO; Manufacturer Part Number: RC0402FR-071KL; Supplier Part Number 1: 311-1.00KLRCT-ND; Supplier 1: Digi-Key; Height: 0.4mm; Package: 0402; value: 1K
R108 = RES 30.1K OHM 1% 1/16W 0402: Manufacturer: YAGEO; Manufacturer Part Number: RC0402FR-0730K1L; Supplier Part Number 1: 311-30.1KLRCT-ND; Supplier 1: Digi-Key; Height: 0.4mm; Package: 0402; value: 30.1K
R111 = RES 22.1K OHM 1% 1/16W 0402: Manufacturer: YAGEO; Manufacturer Part Number: RC0402FR-0722K1L; Supplier Part Number 1: 311-22.1KLRCT-ND; Supplier 1: Digi-Key; Height: 0.4mm; Package: 0402; value: 22.1K
R112 = RES 619 OHM 1% 1/16W 0402: Manufacturer: YAGEO; Manufacturer Part Number: RC0402FR-07619RL; Supplier Part Number 1: YAG3201CT-ND; Supplier 1: Digi-Key; Height: 0.4mm; Package: 0402; value: 619
R113 R119 = RES 2.49K OHM 1% 1/16W 0402: Manufacturer: YAGEO; Manufacturer Part Number: RC0402FR-072K49L; Supplier Part Number 1: 311-2.49KLRCT-ND; Supplier 1: Digi-Key; Height: 0.4mm; Package: 0402; value: 2.49K
T15-T25 T32 T33 T38 T39 = Test point PAD: test point
U6 U20 = MAX25300BATA/V+: Ldo, Adj, 0.6-5.3V, 0.5A, -40 To 125Degc Rohs Compliant: Yes; Manufacturer: Maxim; Supplier 1: Newark; Manufacturer Part Number: MAX25300BATA/V+; RoHS: Yes; Category: Uncategorized; Stock 1: 840; Pricing 1: 1=4.56000, 10=4.09000, 30=3.86000, 100=3.35000, 250=3.18000, 500=2.85000 (USD); Supplier Part Number 1: 15AJ2501
U10 = TPS62903RPJR: 3-V TO 17-V, 3-A, HIGH-EFFICIENC; Manufacturer: Texas Instruments; Supplier 1: Win Source Electronics; Manufacturer Part Number: TPS62903RPJR; RoHS: No; Category: Voltage Regulators - Switching; Supplier Part Number 1: 1127143-TPS62903RPJR
U15 = NCP51402MNTXG: 3 Amp VTT Termination Regulator DDR1, DDR2, DDR3, LPDDR3, DDR4 No droop, 29deg phase margin; Manufacturer: ON Semiconductor; Number of Outputs: 1; Output Voltage: 1.8V; Min Input Voltage: 2.375V; Max Input Voltage: 5.5V; Nominal Output Voltage: 750mV; Output Current: 3A; Output Type: Fixed; Supplier 1: Digi-Key; Manufacturer Part Number: NCP51402MNTXG; RoHS: Yes; Category: Connectors; Stock 1: 10637; Pricing 1: 1=1.55000, 10=1.38500, 25=1.31440, 100=1.07950, 250=1.00916, 500=0.89180, 1000=0.70405 (USD); Mount: Surface Mount; Case/Package: DFN; Number of Pins: 10; Min Operating Temperature: -40°C; Max Operating Temperature: 125°C; Packaging: Cut Tape; Series: -; Reach SVHC Compliant: Yes; Lead Free: Lead Free; RoHS Compliant: Yes; ComponentLink1URL: http://www.farnell.com/datasheets/2355109.pdf?src-supplier=Farnell; ComponentLink1Description: http://www.farnell.com/datasheets/2355109.pdf?src-supplier=Farnell; ComponentLink2URL: http://www.mouser.com/ds/2/308/NCP51402-D-931440.pdf?src-supplier=Mouser; ComponentLink2Description: http://www.mouser.com/ds/2/308/NCP51402-D-931440.pdf?src-supplier=Mouser; ComponentLink3URL: http://www.onsemi.com/pub/Collateral/NCP51402-D.PDF?src-supplier=Digi-Key; ComponentLink3Description: http://www.onsemi.com/pub/Collateral/NCP51402-D.PDF?src-supplier=Digi-Key; ComponentLink4URL: http://www.farnell.com/datasheets/2355109.pdf?src-supplier=Newark; ComponentLink4Description: http://www.farnell.com/datasheets/2355109.pdf?src-supplier=Newark; ComponentLink5URL: http://www.farnell.com/datasheets/2053028.pdf?src-supplier=Element14; ComponentLink5Description: http://www.farnell.com/datasheets/2053028.pdf?src-supplier=Element14; Supplier Part Number 1: NCP51402MNTXGOSCT-ND
U16 = TPS54429ERSAT: IC REG BUCK ADJ 4.5A 16QFN; Manufacturer: Texas Instruments; Output Voltage: 5.5V; Number of Outputs: 1; Switching Frequency: 700kHz; Max Input Voltage: 18V; Min Input Voltage: 7V; Min Output Voltage: 760mV; Synchronous Rectifier: Yes; Quiescent Current: 600uA; Output Type: Adjustable; Output Configuration: Positive; Supplier 1: Digi-Key; Manufacturer Part Number: TPS54429ERSAT; RoHS: Yes; Category: Voltage Regulators - Switching; Stock 1: 475; Pricing 1: 1=2.97000, 10=2.66600, 25=2.51480, 100=2.14270 (USD); Case/Package: VQFN; Number of Pins: 16; Min Operating Temperature: -20°C; Max Operating Temperature: 85°C; Output Current: 4.5A; Packaging: Tape and Reel; Package Quantity: 250; Max Output Current: 4.5A; Max Output Voltage: 5.5V; Operating Supply Voltage: 18V; Series: SWIFT™, D-CAP2™, Eco-Mode™; Lead Free: Lead Free; RoHS Compliant: Yes; ComponentLink1URL: https://datasheet.ciiva.com/14378/slvsas0-14378171.pdf?src-supplier=Avnet; ComponentLink1Description: https://datasheet.ciiva.com/14378/slvsas0-14378171.pdf?src-supplier=Avnet; ComponentLink2URL: https://datasheet.ciiva.com/2035/tps54429e-2035525.pdf?src-supplier=Digi-Key; ComponentLink2Description: https://datasheet.ciiva.com/2035/tps54429e-2035525.pdf?src-supplier=Digi-Key; Supplier Part Number 1: 296-TPS54429ERSATCT-ND
U17 = AP63200WU-7: AP63200 Series 1.2 V 2 A Adjustable Synchronous Buck Converter - TSOT-26; Manufacturer: Diodes; Supplier 1: Digi-Key; Manufacturer Part Number: AP63200WU-7; RoHS: Yes; Category: Voltage Regulators - Switching; Stock 1: 59576; Pricing 1: 1=0.91000, 10=0.79900, 25=0.75040, 100=0.61250, 250=0.56896, 500=0.48420, 1000=0.38737 (USD); Supplier Part Number 1: AP63200WU-7DICT-ND
U18 U19 = NCP59744MN2ADJTBG: NCP59744 Series 3.6 V 3 A Dual-Rail Very Low-Dropout Linear Regulator - QFN-20; Manufacturer: ON Semiconductor; Max Output Current: 6A; Output Voltage: 3.6V; Number of Outputs: 1; Min Input Voltage: 800mV; Max Input Voltage: 5.5V; Output Current: 3A; Min Current Limit: 3.8A; Polarity: Positive; Accuracy: 1%; Dropout Voltage: 195mV; Input Bias Current: 2mA; Operating Supply Current: 1.2mA; Power Supply Rejection Ratio (PSRR): 80dB; Output Type: Adjustable,Fixed; Supplier 1: Mouser; Manufacturer Part Number: NCP59744MN2ADJTBG; RoHS: Yes; Category: Voltage Regulators - Linear; Stock 1: 112; Pricing 1: 1=1.95000, 10=1.75000, 25=1.65000, 50=1.65000, 100=1.41000, 250=1.32000, 500=1.14000, 1000=0.93900, 3000=0.91000, 10000=0.91000 (USD); Mount: Surface Mount; Case/Package: QFN; Number of Pins: 20; Weight: 0.004339oz; Contact Plating: Tin,Matte; Min Operating Temperature: -40°C; Max Operating Temperature: 125°C; Packaging: Tape and Reel; Number of Regulators: 1; Reference Voltage: 800mV; Package Quantity: 3000; Length: 5mm; Width: 5mm; Height: 0.95mm; Radiation Hardening: No; Lead Free: Lead Free; ComponentLink1URL: https://datasheet.ciiva.com/46643/70400732-46643034.pdf?src-supplier=Allied+Electronics; ComponentLink1Description: https://datasheet.ciiva.com/46643/70400732-46643034.pdf?src-supplier=Allied+Electronics; Supplier Part Number 1: 863-NCP59744MN2ADJTB